# Altium schematic sheet MCU RGB.SchDoc: RGB Controller
size A4; SheetNumber: 1; SheetTotal: 1
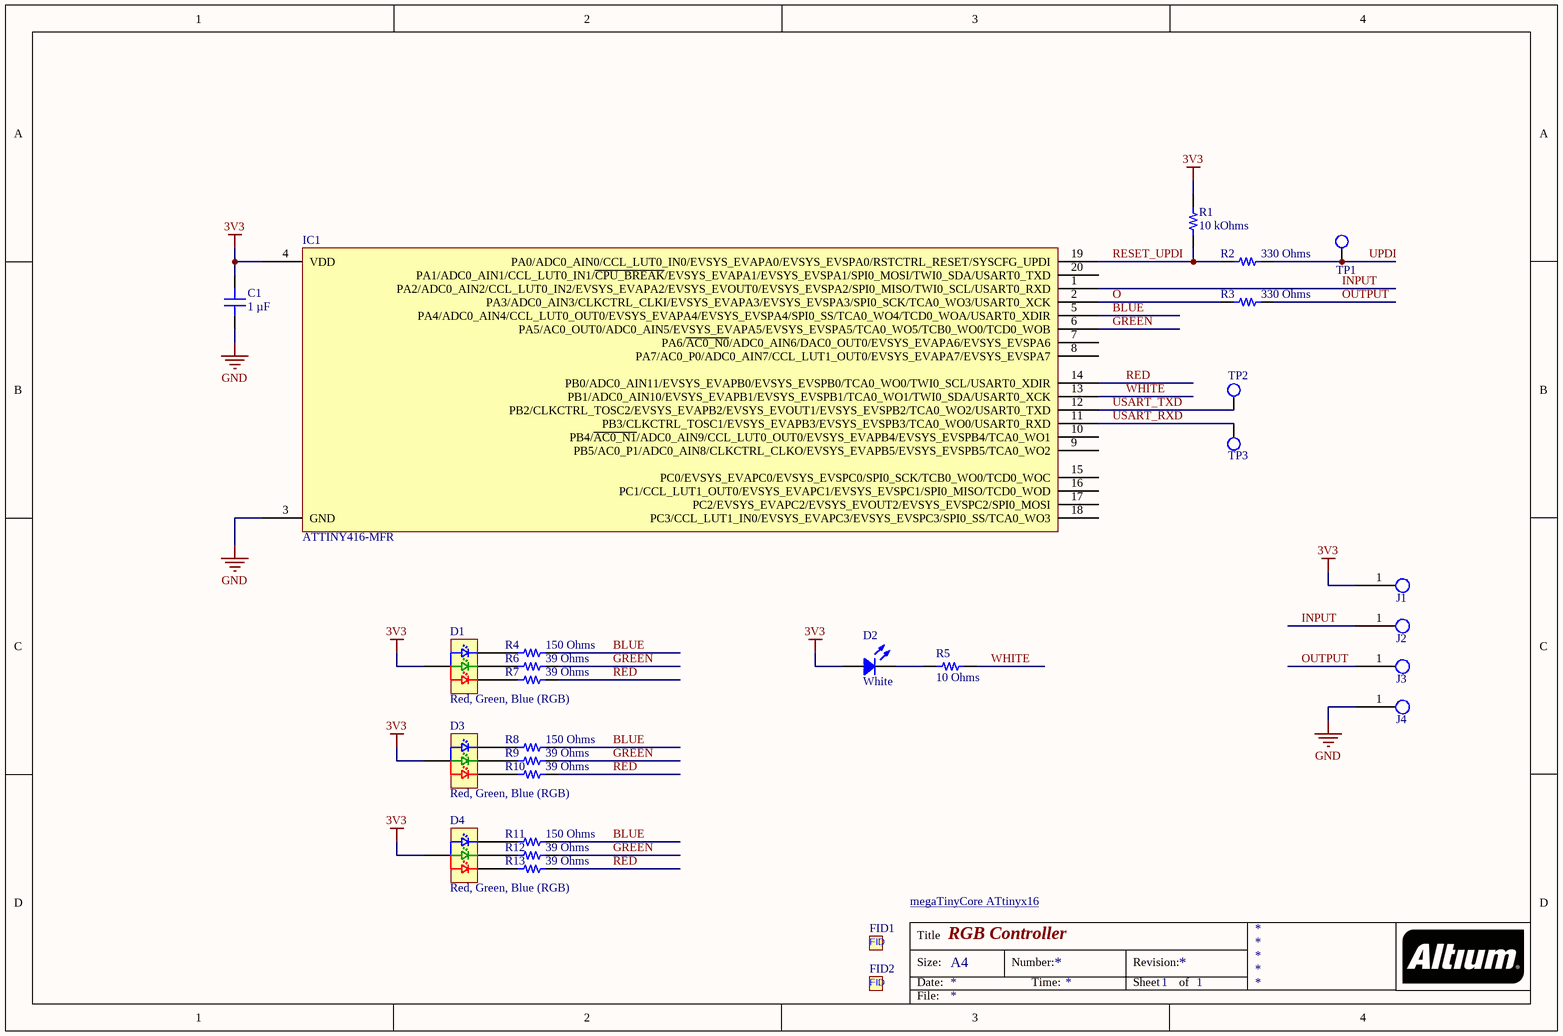
[diagram p0: MCU RGB.SchDoc]

## Parts
C1  1 µF  [CAP 0603_1608]
D1  Red, Green, Blue (RGB)  [Harvatek B38G3RGB-10D0003H2U1930]
D2  White  [LED 0603_1608]
D3  Red, Green, Blue (RGB)  [Harvatek B38G3RGB-10D0003H2U1930]
D4  Red, Green, Blue (RGB)  [Harvatek B38G3RGB-10D0003H2U1930]
FID1  Fiducial  [Fiducial-1mm]  (value not drawn)  (no BOM)
FID2  Fiducial  [Fiducial-1mm]  (value not drawn)  (no BOM)
IC1  ATTINY416-MFR  [MICROCHIP VQFN-20 3X3 REB]
J1  e-tex pad  [MFR PARTNO]  (value not drawn)  (no BOM)
J2  e-tex pad  [MFR PARTNO]  (value not drawn)  (no BOM)
J3  e-tex pad  [MFR PARTNO]  (value not drawn)  (no BOM)
J4  e-tex pad  [MFR PARTNO]  (value not drawn)  (no BOM)
R1  10 kOhms  [RES 0201_0603]
R2  330 Ohms  [RES 0201_0603]
R3  330 Ohms  [RES 0201_0603]
R4  150 Ohms  [RES 0201_0603]
R5  10 Ohms  [RES 0201_0603]
R6  39 Ohms  [RES 0201_0603]
R7  39 Ohms  [RES 0201_0603]
R8  150 Ohms  [RES 0201_0603]
R9  39 Ohms  [RES 0201_0603]
R10  39 Ohms  [RES 0201_0603]
R11  150 Ohms  [RES 0201_0603]
R12  39 Ohms  [RES 0201_0603]
R13  39 Ohms  [RES 0201_0603]
TP1  Test Point  [TestPoint-1.5mm]  (value not drawn)  (no BOM)
TP2  Test Point  [TestPoint-1.5mm]  (value not drawn)  (no BOM)
TP3  Test Point  [TestPoint-1.5mm]  (value not drawn)  (no BOM)

## Nets
3V3: C1.2 D1.3(ANODE) D2.1 D3.3(ANODE) D4.3(ANODE) IC1.4(VDD) J1.1(ETEXTILE) R1.2
GND: C1.1 IC1.3(GND) J4.1(ETEXTILE)
BLUE: IC1.5(PA4/ADC0_AIN4/CCL_LUT0_OUT0/EVSYS_EVAPA4/EVSYS_EVSPA4/SPI0_SS/TCA0_WO4/TCD0_WOA/USART0_XDIR) R4.2 R8.2 R11.2
GREEN: IC1.6(PA5/AC0_OUT0/ADC0_AIN5/EVSYS_EVAPA5/EVSYS_EVSPA5/TCA0_WO5/TCB0_WO0/TCD0_WOB) R6.2 R9.2 R12.2
INPUT: IC1.1(PA2/ADC0_AIN2/CCL_LUT0_IN2/EVSYS_EVAPA2/EVSYS_EVOUT0/EVSYS_EVSPA2/SPI0_MISO/TWI0_SCL/USART0_RXD) J2.1(ETEXTILE)
O: IC1.2(PA3/ADC0_AIN3/CLKCTRL_CLKI/EVSYS_EVAPA3/EVSYS_EVSPA3/SPI0_SCK/TCA0_WO3/USART0_XCK) R3.1
OUTPUT: J3.1(ETEXTILE) R3.2
RED: IC1.14(PB0/ADC0_AIN11/EVSYS_EVAPB0/EVSYS_EVSPB0/TCA0_WO0/TWI0_SCL/USART0_XDIR) R7.2 R10.2 R13.2
RESET_UPDI: IC1.19(PA0/ADC0_AIN0/CCL_LUT0_IN0/EVSYS_EVAPA0/EVSYS_EVSPA0/RSTCTRL_RESET/SYSCFG_UPDI) R1.1 R2.1
UPDI: R2.2 TP1.1(TP)
USART_RXD: IC1.11(PB3/CLKCTRL_TOSC1/EVSYS_EVAPB3/EVSYS_EVSPB3/TCA0_WO0/USART0_RXD) TP3.1(TP)
USART_TXD: IC1.12(PB2/CLKCTRL_TOSC2/EVSYS_EVAPB2/EVSYS_EVOUT1/EVSYS_EVSPB2/TCA0_WO2/USART0_TXD) TP2.1(TP)
WHITE: IC1.13(PB1/ADC0_AIN10/EVSYS_EVAPB1/EVSYS_EVSPB1/TCA0_WO1/TWI0_SDA/USART0_XCK) R5.2
NetD1_1: D1.1(GREEN) R6.1
NetD1_2: D1.2(BLUE) R4.1
NetD1_4: D1.4(RED) R7.1
NetD2_2: D2.2 R5.1
NetD3_1: D3.1(GREEN) R9.1
NetD3_2: D3.2(BLUE) R8.1
NetD3_4: D3.4(RED) R10.1
NetD4_1: D4.1(GREEN) R12.1
NetD4_2: D4.2(BLUE) R11.1
NetD4_4: D4.4(RED) R13.1

Not connected (* = marked no-connect by the designer): IC1 7(PA6/~{AC0_N0}/ADC0_AIN6/DAC0_OUT0/EVSYS_EVAPA6/EVSYS_EVSPA6) 8(PA7/AC0_P0/ADC0_AIN7/CCL_LUT1_OUT0/EVSYS_EVAPA7/EVSYS_EVSPA7) 9(PB5/AC0_P1/ADC0_AIN8/CLKCTRL_CLKO/EVSYS_EVAPB5/EVSYS_EVSPB5/TCA0_WO2) 10(PB4/~{AC0_N1}/ADC0_AIN9/CCL_LUT0_OUT0/EVSYS_EVAPB4/EVSYS_EVSPB4/TCA0_WO1) 15(PC0/EVSYS_EVAPC0/EVSYS_EVSPC0/SPI0_SCK/TCB0_WO0/TCD0_WOC) 16(PC1/CCL_LUT1_OUT0/EVSYS_EVAPC1/EVSYS_EVSPC1/SPI0_MISO/TCD0_WOD) 17(PC2/EVSYS_EVAPC2/EVSYS_EVOUT2/EVSYS_EVSPC2/SPI0_MOSI) 18(PC3/CCL_LUT1_IN0/EVSYS_EVAPC3/EVSYS_EVSPC3/SPI0_SS/TCA0_WO3) 20(PA1/ADC0_AIN1/CCL_LUT0_IN1/~{CPU_BREAK}/EVSYS_EVAPA1/EVSYS_EVSPA1/SPI0_MOSI/TWI0_SDA/USART0_TXD)

## Notes on the sheet
- megaTinyCore ATtinyx16 <https://github.com/SpenceKonde/megaTinyCore/blob/master/megaavr/extras/ATtiny_x16.md>
- Title
- Size:
- Date:
- A4
- Number:
- Time:
- Revision:
- Sheet
- of
- File:
- (in symbol CMP-002-000000-1) FID

## Library data of the parts
C1 = GCM188R71E105KA64D: CAP CER 1UF 25V X7R 0603; manufacturer: Murata Electronics; Tolerance: ±10%; Part Number: GCM188R71E105KA64D; Value: 1 µF; Applications: Automotive; Capacitance: 1 µF; componentlink1description: Datasheet; componentlink1url: https://www.murata.com/~/media/webrenewal/support/library/catalog/products/capacitor/mlcc/c03e.ashx?la=en-us; componentlink2description: DigiKey Link; componentlink2url: https://www.digikey.com/en/products/detail/murata-electronics/GCM188R71E105KA64D/4903956; Device Package: 0603 (1608 Metric); lastupdated: 20/08/2023 19:09:04; Lifecycle Status: Active; Minimum Order: 1; Mounting Type: Surface Mount, MLCC; Operating Temperature: -55°C ~ 125°C; Package / Case: 0603 (1608 Metric); packaging: TapeAndReel; partid: 6762; Part Status: Active; price: 0.03; Ratings: AEC-Q200; series: GCM; Size / Dimension: 0.063" L x 0.031" W (1.60mm x 0.80mm); Supplier 1: DigiKey; Supplier Part Number 1: 490-10673-1-ND; Temperature Coefficient: X7R; Thickness (Max): 0.035" (0.90mm); Voltage - Rated: 25V
D1 D3 D4 = B38G3RGB-10D0003H2U1930: LED RGB MIXED WHITE ( 1.6(L)X1.6; Manufacturer: Harvatek Corporation; Configuration: Common Anode; Current - Test: 10mA Red, 10mA Green, 10mA Blue; Lens Size: 1.60mm x 1.10mm; Lens Style: Rectangle with Flat Top; Millicandela Rating: 630mcd Red, 630mcd Green, 630mcd Blue; Voltage - Forward (Vf) (Typ): 2V Red, 3V Green, 3V Blue; Part Number: B38G3RGB-10D0003H2U1930; Color: Red, Green, Blue (RGB); ComponentLink1Description: Datasheet; ComponentLink1URL: https://media.digikey.com/pdf/Data%20Sheets/Harvatek%20PDFs/B38G3RGB-10D0003H2U1930%20%20V1.9.pdf; ComponentLink2Description: DigiKey Link; ComponentLink2URL: https://www.digikey.com/en/products/detail/harvatek-corporation/B38G3RGB-10D0003H2U1930/13588733; Height (Max): 0.50mm; LastUpdated: 31/10/2023 16:54:14; Lifecycle Status: Active; Minimum Order: 1; Mounting Type: Surface Mount; Packaging: TapeAndReel; PartId: 1416; Part Status: Active; Price: 0.11; Series: -; Size / Dimension: 1.60mm L x 1.60mm W; Supplier 1: DigiKey; Supplier Part Number 1: 3147-B38G3RGB-10D0003H2U1930CT-ND; Supplier Device Package: 0606; Value: Red, Green, Blue (RGB)
D2 = B1931TW--20P000314U1930: 1.6(L)X0.8(W)X0.4(H) MM WHITE LE; Manufacturer: Harvatek Corporation; Current - Test: 20mA; Lens Size: 1.00mm x 0.80mm; Lens Style: Rectangle with Flat Top; Millicandela Rating: 420mcd; Viewing Angle: 135°; Voltage - Forward (Vf) (Typ): 3.2V; Part Number: B1931TW--20P000314U1930; Color: White; ComponentLink1Description: Datasheet; ComponentLink1URL: https://media.digikey.com/pdf/Data%20Sheets/Harvatek%20PDFs/B1931TW--20P000314U1930.pdf; ComponentLink2Description: DigiKey Link; ComponentLink2URL: https://www.digikey.com/en/products/detail/harvatek-corporation/B1931TW-20P000314U1930/14302790; Device Package: 0603 (1608 Metric); Height (Max): 0.50mm; LastUpdated: 30/10/2023 20:29:06; Lifecycle Status: Active; Minimum Order: 1; Mounting Type: Surface Mount; Package / Case: 0603 (1608 Metric); Packaging: TapeAndReel; PartId: 1057; Part Status: Active; Price: 0.05; Series: -; Size / Dimension: 1.60mm L x 0.80mm W; Supplier 1: DigiKey; Supplier Part Number 1: 3147-B1931TW--20P000314U1930CT-ND; Supplier Device Package: 0603; Value: White
FID1 FID2 = CMP-002-000000-1: Design Item ID: Fiducial; Component Type: Standard; Source: Fiducial.SchLib; Pin Count: 0
IC1 = ATTINY416-MFR: IC MCU 8BIT 4KB FLASH 20VQFN; Manufacturer: Microchip Technology; Connectivity: I²C, IrDA, LINbus, SPI, UART/USART; Core Processor: AVR; Core Size: 8-Bit; Data Converters: A/D 12x10b; D/A 1x8b; EEPROM Size: 128 x 8; Number of I/O: 18; Oscillator Type: Internal; Peripherals: Brown-out Detect/Reset, POR, WDT; Program Memory Size: 4KB (4K x 8); RAM Size: 256 x 8; Speed: 16MHz; Voltage - Supply (Vcc/Vdd): 2.7V ~ 5.5V; Part Number: ATTINY416-MFR; ComponentLink1Description: Datasheet; ComponentLink1URL: http://www.microchip.com/mymicrochip/filehandler.aspx?ddocname=en599406; ComponentLink2Description: DigiKey Link; ComponentLink2URL: https://www.digikey.com/en/products/detail/microchip-technology/ATTINY416-MFR/7682214; LastUpdated: 30/10/2023 22:46:36; Lifecycle Status: Active; Minimum Order: 1; Mounting Type: Surface Mount; Operating Temperature: -40°C ~ 125°C (TA); Package / Case: 20-VFQFN Exposed Pad; Packaging: TapeAndReel; PartId: 286; Part Status: Active; Price: 0.66; Program Memory Type: FLASH; Series: tinyAVR™ 1, Functional Safety (FuSa); Supplier 1: DigiKey; Supplier Part Number 1: ATTINY416-MFRCT-ND; Supplier Device Package: 20-VQFN (3x3)
R1 = CR0201-JW-103GLF: RES SMD 10K OHM 5% 1/20W 0201; Manufacturer: Bourns Inc.; Power (Watts): 0.05W, 1/20W; Temperature Coefficient: ±200ppm/°C; Part Number: CR0201-JW-103GLF; Value: 10 kOhms; ComponentLink1Description: Datasheet; ComponentLink1URL: https://www.bourns.com/docs/Product-Datasheets/CR0201.pdf; ComponentLink2Description: DigiKey Link; ComponentLink2URL: https://www.digikey.com/en/products/detail/bourns-inc/CR0201-JW-103GLF/3593182; Composition: Thick Film; Device Package: 0201 (0603 Metric); Height - Seated (Max): 0.010" (0.26mm); LastUpdated: 30/10/2023 19:19:08; Lifecycle Status: Active; Minimum Order: 1; Number of Terminations: 2; Operating Temperature: -55°C ~ 125°C; Package / Case: 0201 (0603 Metric); Packaging: CutTape; PartId: 2265; Part Status: Active; Price: 0.01; Resistance: 10 kOhms; Series: CR0201; Size / Dimension: 0.024" L x 0.012" W (0.60mm x 0.30mm); Supplier 1: DigiKey; Supplier Part Number 1: CR0201-JW-103GLFCT-ND; Supplier Device Package: 0201; Tolerance: ±5%
R2 R3 = WR02X3300FAL: RES 330 OHM 1% 1/20W 0201; Manufacturer: Walsin Technology Corporation; Power (Watts): 0.05W, 1/20W; Temperature Coefficient: ±200ppm/°C; Part Number: WR02X3300FAL; Value: 330 Ohms; ComponentLink1Description: Datasheet; ComponentLink1URL: https://www.passivecomponent.com/wp-content/uploads/chipR/ASC_WR02X.pdf; ComponentLink2Description: DigiKey Link; ComponentLink2URL: https://www.digikey.com/en/products/detail/walsin-technology-corporation/WR02X3300FAL/13240814; Composition: Thick Film; Device Package: 0201 (0603 Metric); Height - Seated (Max): 0.010" (0.26mm); LastUpdated: 30/10/2023 19:18:56; Lifecycle Status: Active; Minimum Order: 1; Number of Terminations: 2; Operating Temperature: -55°C ~ 125°C; Package / Case: 0201 (0603 Metric); Packaging: CutTape; PartId: 64460; Part Status: Active; Price: 0.01; Resistance: 330 Ohms; Series: WR02X; Size / Dimension: 0.024" L x 0.012" W (0.60mm x 0.30mm); Supplier 1: DigiKey; Supplier Part Number 1: 1292-WR02X3300FALCT-ND; Supplier Device Package: 0201; Tolerance: ±1%
R4 R8 R11 = WR02X151 JAL: RES 150 OHM 5% 1/20W 0201; Manufacturer: Walsin Technology Corporation; Power (Watts): 0.05W, 1/20W; Temperature Coefficient: ±200ppm/°C; Part Number: WR02X151 JAL; Value: 150 Ohms; ComponentLink1Description: Datasheet; ComponentLink1URL: https://www.passivecomponent.com/wp-content/uploads/chipR/ASC_WR02X.pdf; ComponentLink2Description: DigiKey Link; ComponentLink2URL: https://www.digikey.com/en/products/detail/walsin-technology-corporation/WR02X151-JAL/13240963; Composition: Thick Film; Device Package: 0201 (0603 Metric); Height - Seated (Max): 0.010" (0.26mm); LastUpdated: 30/10/2023 19:18:56; Lifecycle Status: Active; Minimum Order: 1; Number of Terminations: 2; Operating Temperature: -55°C ~ 125°C; Package / Case: 0201 (0603 Metric); Packaging: CutTape; PartId: 64480; Part Status: Active; Price: 0.01; Resistance: 150 Ohms; Series: WR02X; Size / Dimension: 0.024" L x 0.012" W (0.60mm x 0.30mm); Supplier 1: DigiKey; Supplier Part Number 1: 1292-WR02X151JALCT-ND; Supplier Device Package: 0201; Tolerance: ±5%
R5 = WR02X10R0FAL: RES 10 OHM 1% 1/20W 0201; Manufacturer: Walsin Technology Corporation; Power (Watts): 0.05W, 1/20W; Temperature Coefficient: ±200ppm/°C; Part Number: WR02X10R0FAL; Value: 10 Ohms; ComponentLink1Description: Datasheet; ComponentLink1URL: https://www.passivecomponent.com/wp-content/uploads/chipR/ASC_WR02X.pdf; ComponentLink2Description: DigiKey Link; ComponentLink2URL: https://www.digikey.com/en/products/detail/walsin-technology-corporation/WR02X10R0FAL/13240733; Composition: Thick Film; Device Package: 0201 (0603 Metric); Height - Seated (Max): 0.010" (0.26mm); LastUpdated: 30/10/2023 19:18:56; Lifecycle Status: Active; Minimum Order: 1; Number of Terminations: 2; Operating Temperature: -55°C ~ 125°C; Package / Case: 0201 (0603 Metric); Packaging: CutTape; PartId: 64452; Part Status: Active; Price: 0.01; Resistance: 10 Ohms; Series: WR02X; Size / Dimension: 0.024" L x 0.012" W (0.60mm x 0.30mm); Supplier 1: DigiKey; Supplier Part Number 1: 1292-WR02X10R0FALCT-ND; Supplier Device Package: 0201; Tolerance: ±1%
R6 R7 R9 R10 R12 R13 = CR0201-JW-390GLF: RES SMD 39 OHM 5% 1/20W 0201; Manufacturer: Bourns Inc.; Power (Watts): 0.05W, 1/20W; Temperature Coefficient: ±200ppm/°C; Part Number: CR0201-JW-390GLF; Value: 39 Ohms; ComponentLink1Description: Datasheet; ComponentLink1URL: https://www.bourns.com/docs/product-datasheets/cr.pdf?sfvrsn=574d41f6_14; ComponentLink2Description: DigiKey Link; ComponentLink2URL: https://www.digikey.com/en/products/detail/bourns-inc/CR0201-JW-390GLF/3783095; Composition: Thick Film; Device Package: 0201 (0603 Metric); Height - Seated (Max): 0.010" (0.26mm); LastUpdated: 30/10/2023 19:18:53; Lifecycle Status: Active; Minimum Order: 1; Number of Terminations: 2; Operating Temperature: -55°C ~ 125°C; Package / Case: 0201 (0603 Metric); Packaging: CutTape; PartId: 78563; Price: 0.01; Resistance: 39 Ohms; Series: CR0201; Size / Dimension: 0.024" L x 0.012" W (0.60mm x 0.30mm); Supplier 1: DigiKey; Supplier Part Number 1: 118-CR0201-JW-390GLFCT-ND; Supplier Device Package: 0201; Tolerance: ±5%
TP1-TP3 = CMP-003-000000-1: Component Type: Standard (No BOM); Source: Test Point.SchLib; Design Item ID: Test Point; Pin Count: 1